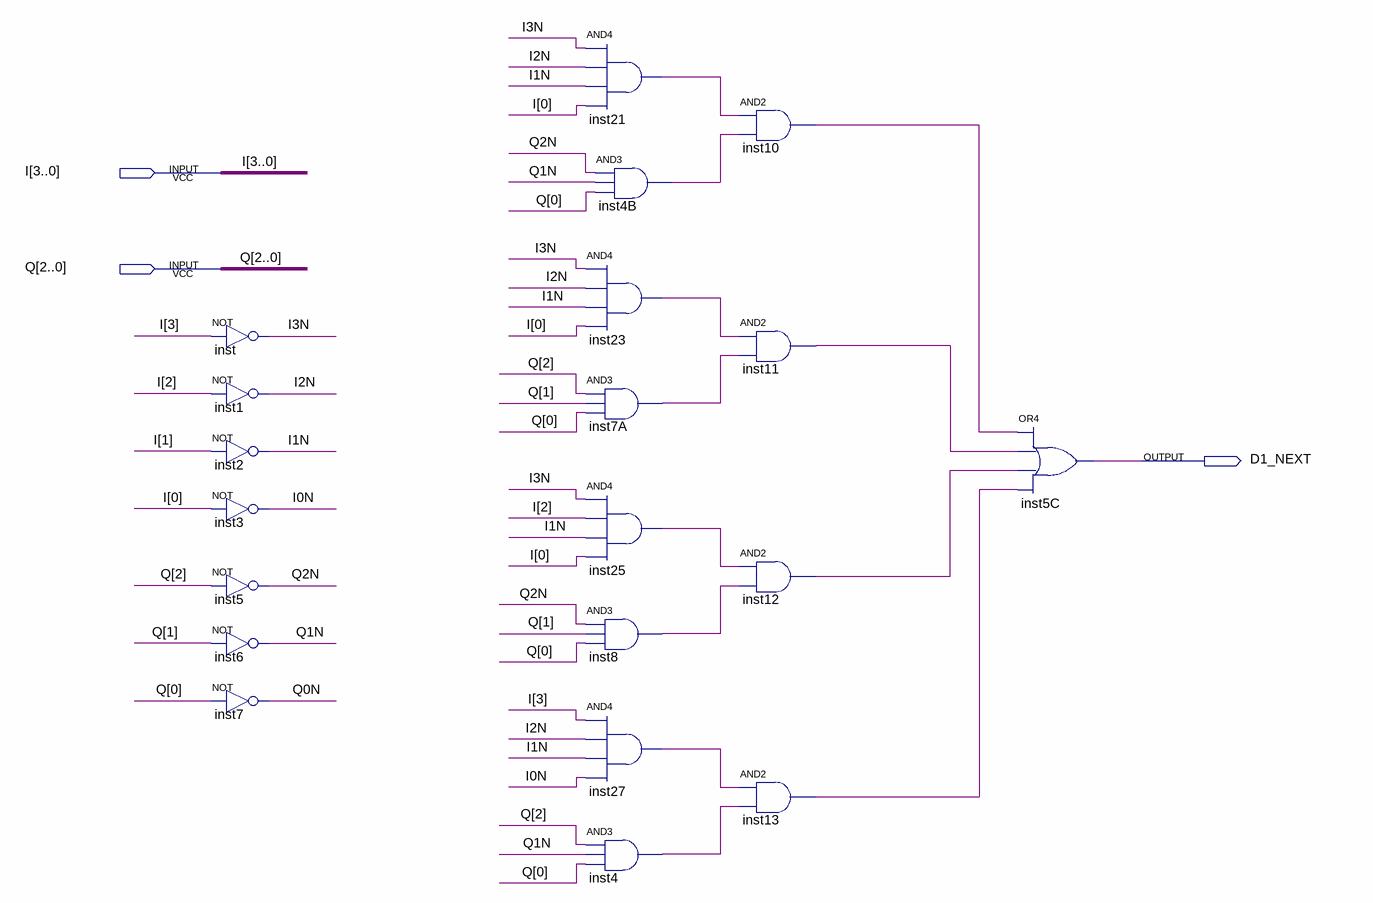
[diagram p0: schematic sheet]
// Quartus schematic D1_GEN_2.bdf as structural Verilog: 20 symbols, 3 pins
module D1_GEN_2 (
  input  [3:0] I,
  input  [2:0] Q,
  output D1_NEXT
);

  wire I0N, I1N, I2N, I3N, inst4_out, inst4B_out, inst7A_out, inst8_out, inst10_out, inst11_out, inst12_out,
       inst13_out, inst21_out, inst23_out, inst25_out, inst27_out, Q0N, Q1N, Q2N;

  not inst (I3N, I[3]);
  not inst1 (I2N, I[2]);
  not inst2 (I1N, I[1]);
  not inst3 (I0N, I[0]);
  not inst5 (Q2N, Q[2]);
  not inst6 (Q1N, Q[1]);
  not inst7 (Q0N, Q[0]);
  and inst21 (inst21_out, I3N, I2N, I1N, I[0]);
  and inst23 (inst23_out, I3N, I2N, I1N, I[0]);
  and inst7A (inst7A_out, Q[2], Q[1], Q[0]);
  and inst25 (inst25_out, I3N, I[2], I1N, I[0]);
  and inst8 (inst8_out, Q2N, Q[1], Q[0]);
  and inst27 (inst27_out, I[3], I2N, I1N, I0N);
  and inst4 (inst4_out, Q[2], Q1N, Q[0]);
  and inst4B (inst4B_out, Q2N, Q1N, Q[0]);
  and inst10 (inst10_out, inst21_out, inst4B_out);
  and inst11 (inst11_out, inst23_out, inst7A_out);
  and inst12 (inst12_out, inst25_out, inst8_out);
  and inst13 (inst13_out, inst27_out, inst4_out);
  or inst5C (D1_NEXT, inst10_out, inst11_out, inst12_out, inst13_out);
endmodule
